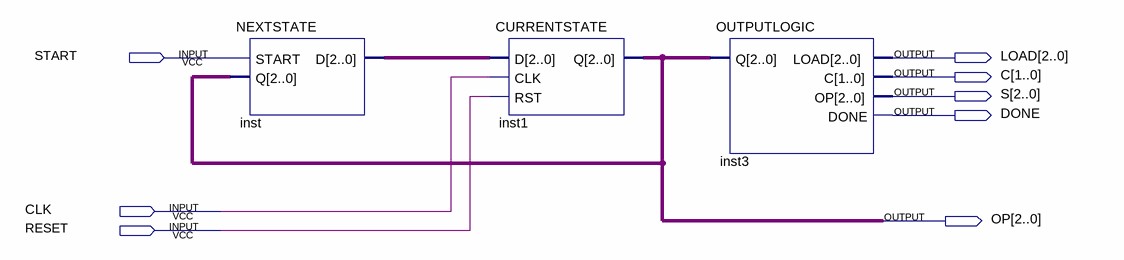
[diagram p0: schematic sheet]
// Quartus schematic Control.bdf as structural Verilog: 3 symbols, 8 pins
module Control (
  input  START,
  input  CLK,
  input  RESET,
  output [2:0] LOAD,
  output [1:0] C,
  output [2:0] S,
  output DONE,
  output [2:0] OP
);

  wire [2:0] inst_d;

  NEXTSTATE inst (.START(START), .Q(OP), .D(inst_d));
  CURRENTSTATE inst1 (.D(inst_d), .CLK(CLK), .RST(RESET), .Q(OP));
  OUTPUTLOGIC inst3 (.Q(OP), .LOAD(LOAD), .C(C), .OP(S), .DONE(DONE));
endmodule
